# Altium schematic sheet MSE450_G05_ASTEROIDS.SchDoc
size B
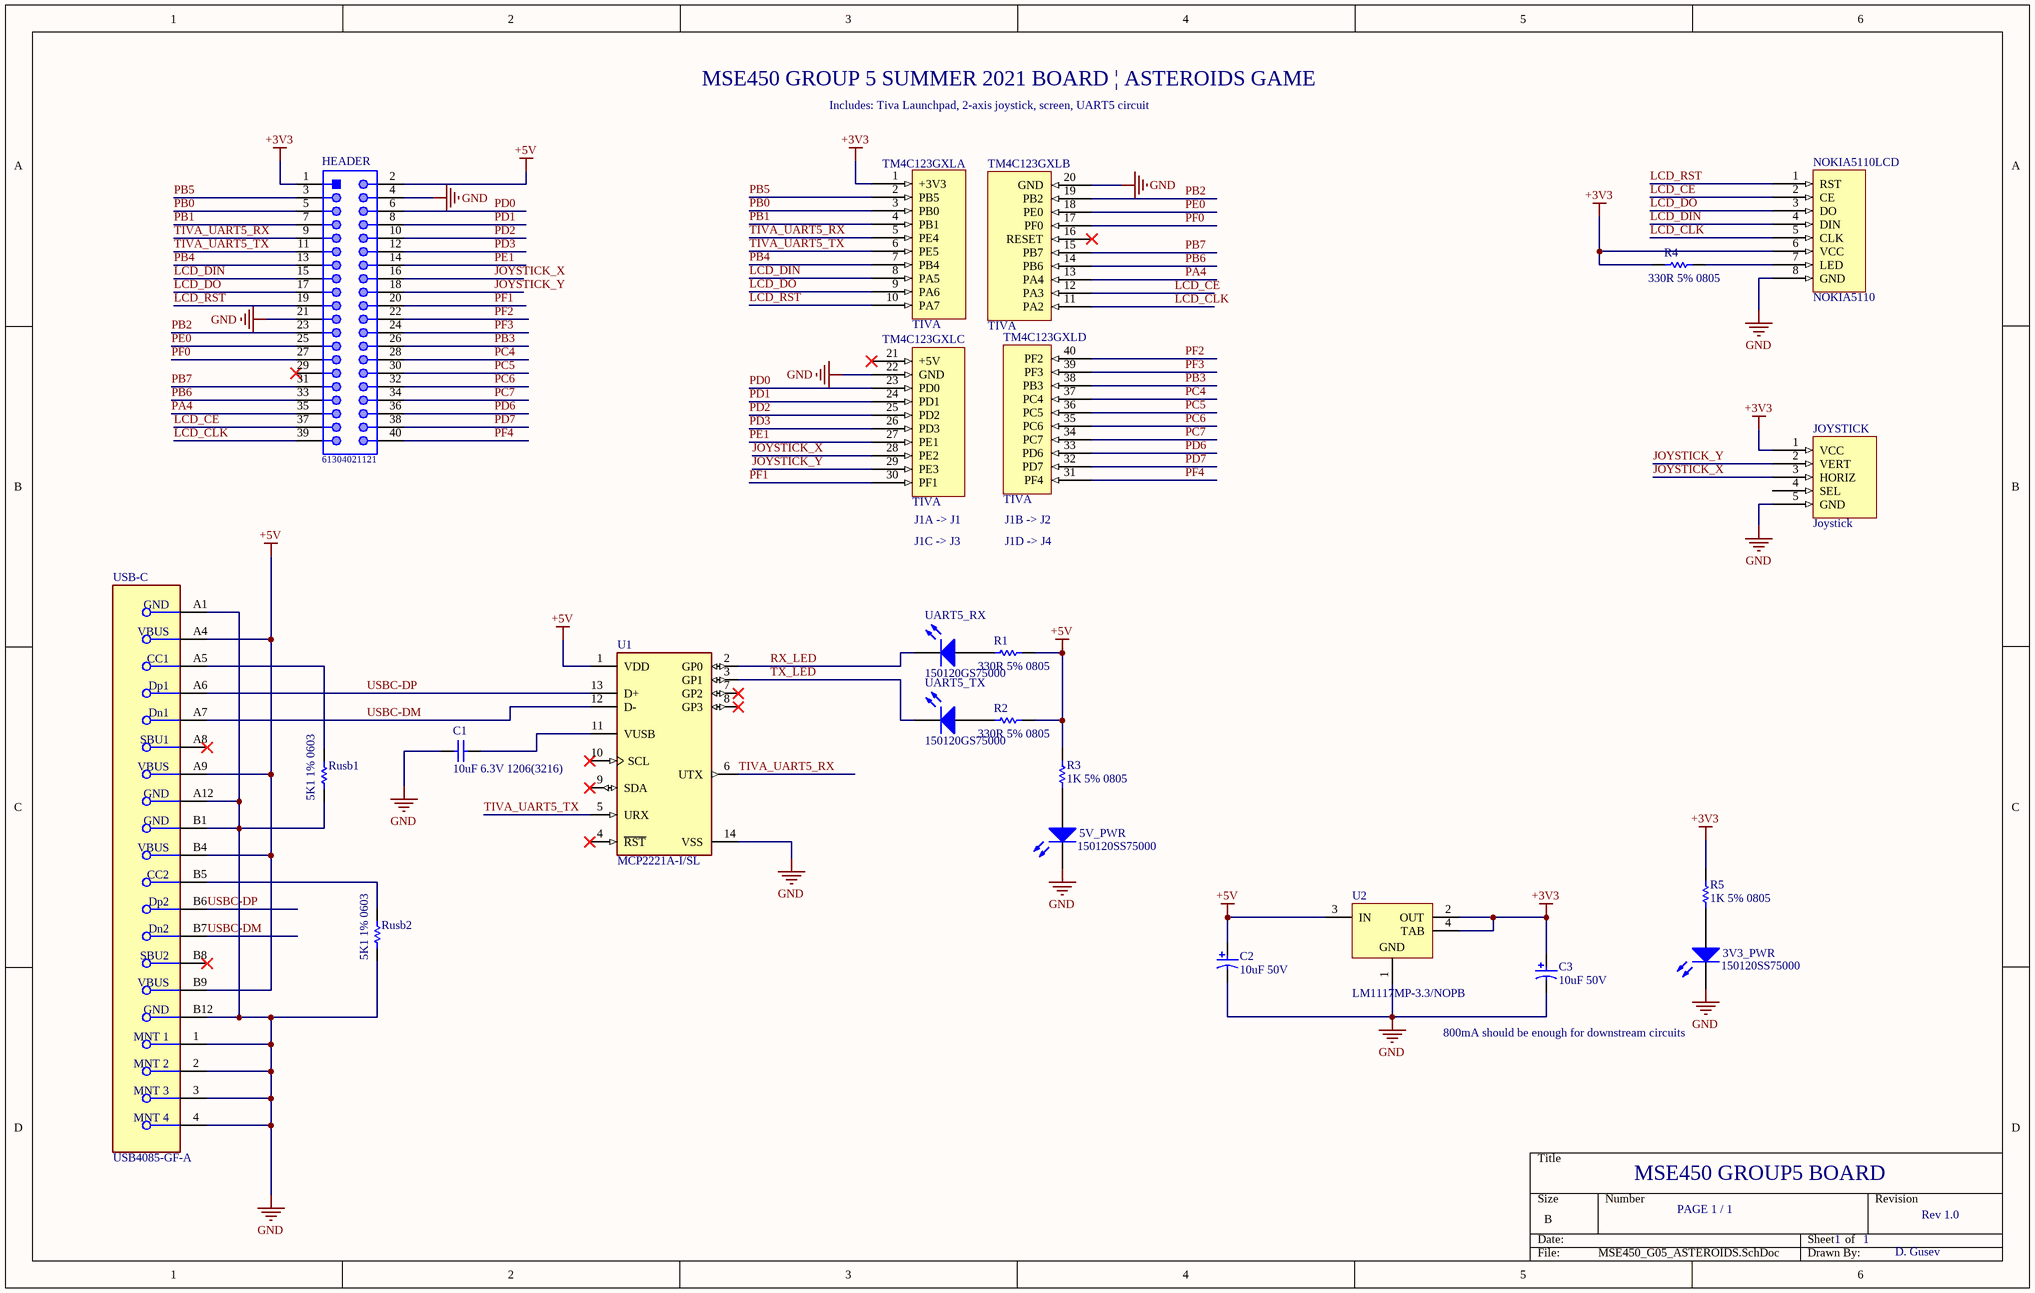
[diagram p0: MSE450_G05_ASTEROIDS.SchDoc]

## Parts
3V3_PWR  150120SS75000  [1206_A]
5V_PWR  150120SS75000  [1206_A]
C1  10uF 6.3V 1206(3216)  [CAPC1206(3216)190_N]
C2  10uF 50V  [PNSC-FK-V-D_V]
C3  10uF 50V  [PNSC-FK-V-D_V]
HEADER  61304021121  [61304021121]
JOYSTICK  Joystick  [joystick]
NOKIA5110LCD  NOKIA5110  [NOKIA5110]
R1  330R 5% 0805  [RESC2013X60X40ML20T25]
R2  330R 5% 0805  [RESC2013X60X40ML20T25]
R3  1K 5% 0805  [RESC2013X60X40ML20T25]
R4  330R 5% 0805  [RESC2013X60X40ML20T25]
R5  1K 5% 0805  [RESC2013X60X40ML20T25]
Rusb1  5K1 1% 0603  [RESC1608X55X25ML10T15]
Rusb2  5K1 1% 0603  [RESC1608X55X25ML10T15]
TM4C123GXL  TIVA  [TIVA]  (parts A,B,C,D of 4)
U1  MCP2221A-I/SL  [FP-C04-065-SL-MFG]
U2  LM1117MP-3.3/NOPB  [DCY0004A_L]
UART5_RX  150120GS75000  [1206_A]
UART5_TX  150120GS75000  [1206_A]
USB-C  USB4085-GF-A  [FP-USB4085-GF-A-MFG]

## Nets
+3V3: C3.1 HEADER.1 JOYSTICK.1(VCC) NOKIA5110LCD.6(VCC) R4.2 R5.1 TM4C123GXL.1(+3V3) U2.2(OUT) U2.4(TAB)
+5V: C2.1 HEADER.2 R1.1 R2.1 R3.1 U1.1(VDD) U2.3(IN) USB-C.A4(VBUS) USB-C.A9(VBUS) USB-C.B4(VBUS) USB-C.B9(VBUS)
GND: 3V3_PWR.1(K) 5V_PWR.1(K) C1.1 C2.2 C3.2 HEADER.4 HEADER.21 JOYSTICK.5(GND) NOKIA5110LCD.8(GND) Rusb1.1 Rusb2.1 TM4C123GXL.20(GND) TM4C123GXL.22(GND) U1.14(VSS) U2.1(GND) USB-C.1(MNT_1) USB-C.2(MNT_2) USB-C.3(MNT_3) USB-C.4(MNT_4) USB-C.A1(GND) USB-C.A12(GND) USB-C.B1(GND) USB-C.B12(GND)
JOYSTICK_X: HEADER.16 JOYSTICK.3(HORIZ) TM4C123GXL.28(PE2)
JOYSTICK_Y: HEADER.18 JOYSTICK.2(VERT) TM4C123GXL.29(PE3)
LCD_CE: HEADER.37 NOKIA5110LCD.2(CE) TM4C123GXL.12(PA3)
LCD_CLK: HEADER.39 NOKIA5110LCD.5(CLK) TM4C123GXL.11(PA2)
LCD_DIN: HEADER.15 NOKIA5110LCD.4(DIN) TM4C123GXL.8(PA5)
LCD_DO: HEADER.17 NOKIA5110LCD.3(DO) TM4C123GXL.9(PA6)
LCD_RST: HEADER.19 NOKIA5110LCD.1(RST) TM4C123GXL.10(PA7)
PA4: HEADER.35 TM4C123GXL.13(PA4)
PB0: HEADER.5 TM4C123GXL.3(PB0)
PB1: HEADER.7 TM4C123GXL.4(PB1)
PB2: HEADER.23 TM4C123GXL.19(PB2)
PB3: HEADER.26 TM4C123GXL.38(PB3)
PB4: HEADER.13 TM4C123GXL.7(PB4)
PB5: HEADER.3 TM4C123GXL.2(PB5)
PB6: HEADER.33 TM4C123GXL.14(PB6)
PB7: HEADER.31 TM4C123GXL.15(PB7)
PC4: HEADER.28 TM4C123GXL.37(PC4)
PC5: HEADER.30 TM4C123GXL.36(PC5)
PC6: HEADER.32 TM4C123GXL.35(PC6)
PC7: HEADER.34 TM4C123GXL.34(PC7)
PD0: HEADER.6 TM4C123GXL.23(PD0)
PD1: HEADER.8 TM4C123GXL.24(PD1)
PD2: HEADER.10 TM4C123GXL.25(PD2)
PD3: HEADER.12 TM4C123GXL.26(PD3)
PD6: HEADER.36 TM4C123GXL.33(PD6)
PD7: HEADER.38 TM4C123GXL.32(PD7)
PE0: HEADER.25 TM4C123GXL.18(PE0)
PE1: HEADER.14 TM4C123GXL.27(PE1)
PF0: HEADER.27 TM4C123GXL.17(PF0)
PF1: HEADER.20 TM4C123GXL.30(PF1)
PF2: HEADER.22 TM4C123GXL.40(PF2)
PF3: HEADER.24 TM4C123GXL.39(PF3)
PF4: HEADER.40 TM4C123GXL.31(PF4)
RX_LED: U1.2(GP0) UART5_RX.1(K)
TIVA_UART5_RX: HEADER.9 TM4C123GXL.5(PE4) U1.6(UTX)
TIVA_UART5_TX: HEADER.11 TM4C123GXL.6(PE5) U1.5(URX)
TX_LED: U1.3(GP1) UART5_TX.1(K)
USBC-DM: U1.12(D-) USB-C.A7(Dn1) USB-C.B7(Dn2)
USBC-DP: U1.13(D+) USB-C.A6(Dp1) USB-C.B6(Dp2)
Net3V3_PWR_2: 3V3_PWR.2(A) R5.2
Net5V_PWR_2: 5V_PWR.2(A) R3.2
NetC1_2: C1.2 U1.11(VUSB)
NetNOKIA5110LCD_7: NOKIA5110LCD.7(LED) R4.1
NetR1_2: R1.2 UART5_RX.2(A)
NetR2_2: R2.2 UART5_TX.2(A)
NetRusb1_2: Rusb1.2 USB-C.A5(CC1)
NetRusb2_2: Rusb2.2 USB-C.B5(CC2)

Not connected (* = marked no-connect by the designer): HEADER 29*; JOYSTICK 4(SEL); TM4C123GXL 16(RESET)* 21(+5V)*; U1 4(~{RST})* 7(GP2)* 8(GP3)* 9(SDA)* 10(SCL)*; USB-C A8(SBU1)* B8(SBU2)*

## Notes on the sheet
- MSE450 GROUP 5 SUMMER 2021 BOARD | ASTEROIDS GAME
- Includes: Tiva Launchpad, 2-axis joystick, screen, UART5 circuit
- (near TM4C123GXL) J1A -> J1
- (near TM4C123GXL) J1C -> J3
- (near TM4C123GXL) J1B -> J2
- J1D -> J4
- 800mA should be enough for downstream circuits
- MSE450 GROUP5 BOARD
- PAGE 1 / 1
- 1
- Rev 1.0
- D. Gusev

## Library data of the parts
3V3_PWR 5V_PWR = CMP-1426-00017-1: SMD mono-color Chip LED, WL-SMCW, Super Red; Manufacturer: Wuerth Elektronik; ComponentLink1URL: http://www.we-online.com; PackageReference: 1206_A; ComponentLink2Description: Datasheet; ComponentLink1Description: Manufacturer URL; ComponentLink2URL: http://katalog.we-online.com/led/datasheet/150120SS75000.pdf; Color: Super Red; PartNumber: 150120SS75000
C1 = CMP-1037-04961-1: CAP 10uF 6.3V ±10% 1206 (3216 Metric) Thickness 1.9mm SMD; Tolerance: Â±10%; Case-EIA: 1206; Case-Metric: 3216; Value: 10uF; Max Thickness: 1.9 mm; Technology: SMT; Rated Voltage: 6.3 V
C2 C3 = CMP-2000-06207-1: Aluminum Electrolytic Capacitor, 10 uF, +/- 20%, 50 V, 2-Pin SMD (Size Code D), -55 to 105 degC, RoHS, Tape and Reel; Manufacturer: Panasonic; Lifetime@Temperature: 2000Hrs@105°C; Type: Can; Ripple Current: 165mA; Impedance: 0.88O; Capacitance: 10µF; Manufacturer URL: http://www.panasonic.com/; Mounting Technology: SurfaceMount; Rated Voltage: 50V; Datasheet URL: http://industrial.panasonic.com/cdbs/www-data/pdf/RDE0000/ABA0000C1181.pdf; Package Reference: FK-V-D; Series: FK; Operating Temp Range: -55to+105°C; Operating Temp-Max: 105°C; Datasheet Version: 03/2016; Package URL: http://industrial.panasonic.com/cdbs/www-data/pdf/RDE0000/DME0000COL48.pdf; Case Size/Dimension: Ø6.3x5.8mm; Package Description: 2-Pin Electrolytic Aluminum Capacitor, Body 6.6 x 6.6 mm
HEADER = CMP-1502-01135-1: THT Vertical Pin Header WR-PHD, Pitch 2.54 mm, Dual Row, 40 pins; Manufacturer: Wurth Elektronik; Contact Resistance: 20mOhm; Pitch: 2.54mm; Pin Number: 40; Withstanding Voltage: 500VAC; Gender: Male; Rated Current: 3A; Working Voltage: 250VAC; Operating Temperature: -40to105degC; Manufacturer URL: http://www.we-online.de; Orientation: Vertical; Datasheet URL: https://katalog.we-online.de/em/datasheet/6130xx21121.pdf; Package Reference: 61304021121; Row Number: Dual; Part Number: 61304021121; Packaging: Bag; Mounting Technology: THT; Publisher: WurthElektronik
R1-R5 = CMP-2001-00590-1: Part Number: ERA6AEB123V; Manufacturer: Panasonic
Rusb1 Rusb2 = CMP-2000-04091-1: Manufacturer: Yageo; Part Number: RC0603FR-075K1L
U1 = CMP-06284-000011-1: IC USB TO I2C/UART 14SOIC; Manufacturer: Microchip; Min Supply Voltage: 3V; Usb Standard: USB 2.0; Max Supply Voltage: 5.5V; Nominal Supply Current: 10-13mA; Automotive Grade: Grade 3; Interface: I2C,UART,USB; Standoff Height: 0.1mm; Max Junction Temp: +150°C; Data Rate: 12Mbits/s; Lead Free: Yes; Height: 1.75mm; Octopart: https://octopart.com/mcp2221a-i%2Fsl-microchip-71704986; Package: C04-065-SL; Digikey Description: IC USB TO I2C/UART 14SOIC; Temperature Range Low: -40°C; Temperature: -40°C to +85°C; Category: IC; Temperature Range High: +85°C; Ambient Temperature Range Low: -40°C; Device Class L1: Integrated Circuits (ICs); Footprint Url: http://ww1.microchip.com/downloads/en/DeviceDoc/14L%20SOIC%203_90%20mm%20%28SL%29%20C04-00065d.pdf; Automotive: Yes; ComponentLink2URL: http://ww1.microchip.com/downloads/en/DeviceDoc/20005565B.pdf; Ambient Temperature Range High: +85°C; RoHS: TRUE; Device Class L3: USB Interface ICs; ComponentLink2Description: Datasheet; Device Class L2: Interface ICs; Manufacturer Part Number: MCP2221A-I/SL; Ipc Land Pattern Name: SOIC127P600X175-14
U2 = CMP-0062-01638-4: 800mA Low-Dropout Linear Regulator, 4-pin SOT-223, Pb-Free; Manufacturer: Texas Instruments; CompType: LDO IC; PackageTopMarking: XYTT*N05A; High-Reliability: Y; PowerWise: N; ComponentLink1URL: http://www.ti.com/general/docs/lit/getliterature.tsp?genericPartNumber=LM1117-N&fileType=pdf; PinCount: 4; PackageDescription: Molded SOT-223, 6.50 x 3.56 x 1.6mm Body, 4 Lead, 2.3mm Pitch; Code_IPC: SOT223-4; PartNumber: LM1117MP-3.3/NOPB; Code_JEDEC: TO-261-AA; RoHS: Y; PackageReference: DCY0004A; ComponentLink1Description: Datasheet URL
UART5_RX UART5_TX = CMP-1426-00014-1: SMD mono-color Chip LED, WL-SMCW, Green; Manufacturer: Wuerth Elektronik; PackageReference: 1206_A; PartNumber: 150120GS75000; ComponentLink1Description: Manufacturer URL; ComponentLink2URL: http://katalog.we-online.com/led/datasheet/150120GS75000.pdf; ComponentLink2Description: Datasheet; Color: Green; ComponentLink1URL: http://www.we-online.com
USB-C = CMP-196119-000001-1: CONN RCPT USB2.0 TYPEC 16POS; Manufacturer: Global Connector Technology; Voltage Rating: 20V; Conn Orientation: Right Angle; Shielding: true; Current Rating: 4.25A; Number Of Contacts: 16; Pitch: 0.85mm; Is Female: yes; ComponentLink2URL: https://gct.co/files/drawings/usb4085.pdf; Category: Conn; Automotive: No; ComponentLink2Description: Datasheet; Height: 3.66mm; Manufacturer Part Number: USB4085-GF-A; Package: 0; Usb Standard: USB 2.0; Octopart: https://octopart.com/usb4085-gf-a-global+connector+technology-94773699; Device Class L3: unset; Digikey Description: CONN RCPT USB2.0 TYPEC 16POS; Temperature Range Low: -40°C; Temperature: -40°C to +85°C; Lead Free: Yes; Contact Material: Gold,Nickel; Device Class L1: Connectors; Temperature Range High: +85°C; Device Class L2: USB Connectors; RoHS: TRUE